# EAGLE design ntpi_adapter_v1_led (EAGLE 6.4)
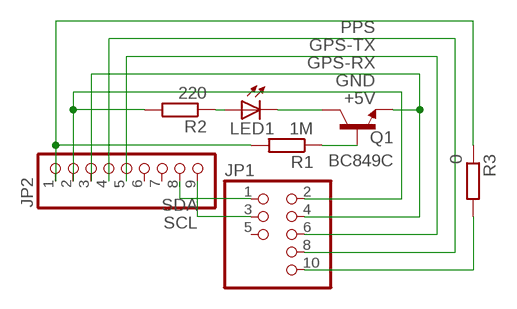
[diagram p0: schematic, sheet 1]

## Parts
JP1  PINHEAD-NTPI  [PINHEAD-NTPI]
JP2  PINHD-1X9  [1X09]
LED1  LEDCHIPLED_0805  [CHIPLED_0805]
Q1  BC849C  BC848ASMD  [SOT23]
R1  1M  R-EU_R0805W  [R0805W]
R2  220  R-EU_R0805W  [R0805W]
R3  0  R-EU_R0805W  [R0805W]

## Nets
+5V: JP1.2 JP2.2 R2.2
GND: JP1.4 JP2.3 Q1.2(E)
GPS-RX: JP1.6 JP2.5
GPS-TX: JP1.8 JP2.4
N$1: JP1.10 R3.2
N$2: LED1.A R2.1
N$3: LED1.C Q1.3(C)
N$4: Q1.1(B) R1.1
PPS: JP2.1 R1.2 R3.1
SCL: JP1.3 JP2.9
SDA: JP1.1 JP2.8
Unconnected: JP1.5 JP2.6 JP2.7

## Library data of the parts
JP1 = frell2:PINHEAD-NTPI
JP2 = pinhead:PINHD-1X9: PIN HEADER
LED1 = led:LED: LED OSRAM: - CHIPLED LG R971, LG N971, LY N971, LG Q971, LY Q971, LO R971, LY R971 LH N974, LH R974 LS Q976, LO Q976, LY Q976 LO Q996 - Hyper CHIPLED LW Q18S LB Q993, LB Q99A, LB R99A - SideLED LS A670, LO A670, LY A670, LG A670, LP A670 LB A673, LV A673, LT A673, LW A673 LH A674 LY A675 LS A676, LA A676, LO A676, LY A676, LW A676 LS A679, LY A679, LG A679 - Hyper Micro SIDELED® LS Y876, LA Y876, LO Y876, LY Y876 LT Y87S - SmartLED LW L88C, LW L88S LB L89C, LB L89S, LG L890 LS L89K, LO L89K, LY L89K LS L896, LA L896, LO L896, LY L896 - TOPLED LS T670, LO T670, LY T670, LG T670, LP T670 LSG T670, LSP T670, LSY T670, LOP T670, LYG T670 LG T671, LOG T671, LSG T671 LB T673, LV T673, LT T673, LW T673 LH T674 LS T676, LA T676, LO T676, LY T676, LB T676, LH T676, LSB T676, LW T676 LB T67C, LV T67C, LT T67C, LS T67K, LO T67K, LY T67K, LW E67C LS E67B, LA E67B, LO E67B, LY E67B, LB E67C, LV E67C, LT E67C LW T67C LS T679, LY T679, LG T679 LS T770, LO T770, LY T770, LG T770, LP T770 LB T773, LV T773, LT T773, LW T773 LH T774 LS E675, LA E675, LY E675, LS T675 LS T776, LA T776, LO T776, LY T776, LB T776 LHGB T686 LT T68C, LB T68C - Hyper Mini TOPLED® LB M676 - Mini TOPLED Santana® LG M470 LS M47K, LO M47K, LY M47K Source: http://www.osram.convergy.de LUXEON: - LUMILED® LXK2-PW12-R00, LXK2-PW12-S00, LXK2-PW14-U00, LXK2-PW14-V00 LXK2-PM12-R00, LXK2-PM12-S00, LXK2-PM14-U00 LXK2-PE12-Q00, LXK2-PE12-R00, LXK2-PE12-S00, LXK2-PE14-T00, LXK2-PE14-U00 LXK2-PB12-K00, LXK2-PB12-L00, LXK2-PB12-M00, LXK2-PB14-N00, LXK2-PB14-P00, LXK2-PB14-Q00 LXK2-PR12-L00, LXK2-PR12-M00, LXK2-PR14-Q00, LXK2-PR14-R00 LXK2-PD12-Q00, LXK2-PD12-R00, LXK2-PD12-S00 LXK2-PH12-R00, LXK2-PH12-S00 LXK2-PL12-P00, LXK2-PL12-Q00, LXK2-PL12-R00 Source: www.luxeon.com KINGBRIGHT: KA-3528ASYC Source: www.kingbright.com
Q1 = transistor-npn:BC848*: NPN Transistor
R1-R3 = resistor:R-EU_: RESISTOR, European symbol

## Board
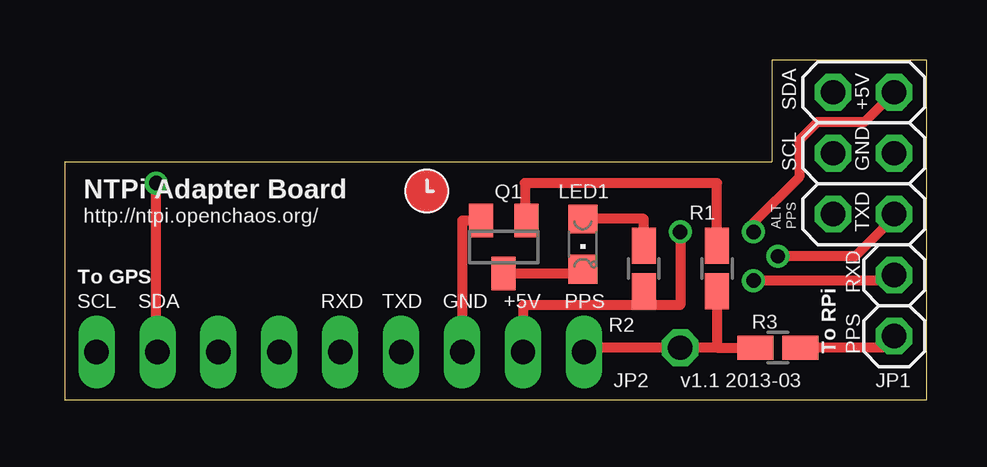
[diagram p1: board, top side]
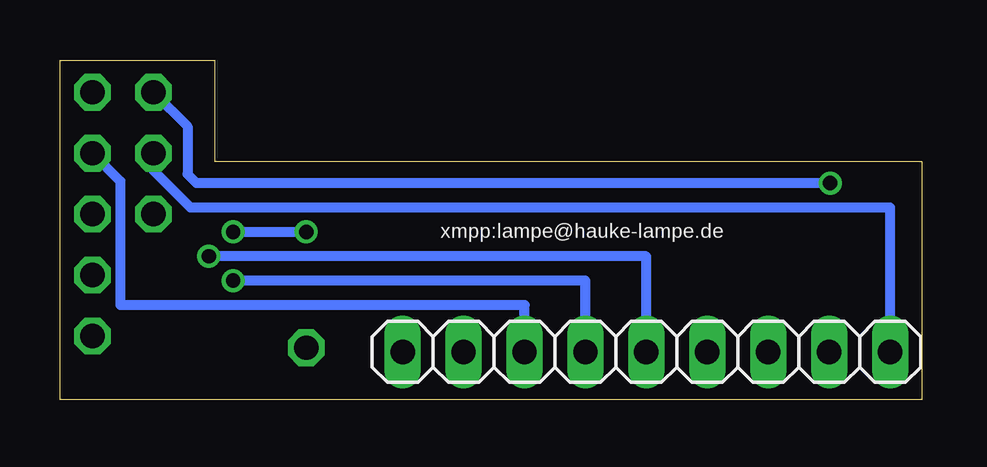
[diagram p2: board, bottom side, seen from below]

Size 35.92 x 14.15 mm. Coordinates in mm from the lower left corner, seen from the top.
Outline: 0,0 35.92,0 35.92,14.15 29.46,14.15 29.46,9.91 0,9.91 0,0
Copper layers (1*16): Top 0.0356mm / dielectric 1.5011mm / Bottom 0.0356mm
Design rules "LaenPCBOrder *": minimum track width 6mil, minimum drill 13mil, track to track 6mil, track to pad 6mil, pad to pad 6mil, via to via 6mil, smd to smd 6mil, copper to edge 15mil, drill to drill 6mil, minimum pad ring 7mil, minimum via ring 7mil, stop-mask expansion 4mil, vias tented up to drill 50mil, thermal gap 10mil

### Footprints (pad centres in the part's own frame; a part is rotated, then mirrored left to right if it is on the bottom)
PINHEAD-NTPI = drill 1.016 octagon: 1 -5.08,-1.27; 2 -5.08,1.27; 3 -2.54,-1.27; 4 -2.54,1.27; 5 0,-1.27; 6 0,1.27; 8 2.54,1.27; 10 5.08,1.27
1X09 = drill 1.016 long: 1 -10.16,0; 2 -7.62,0; 3 -5.08,0; 4 -2.54,0; 5 0,0; 6 2.54,0; 7 5.08,0; 8 7.62,0; 9 10.16,0
CHIPLED_0805 = smd 1.2 x 1.2: A 0,-1.05; C 0,1.05
SOT23 = smd 1 x 1.4: 1 -0.95,-1.1; 2 0.95,-1.1; 3 0,1.1
R0805W = smd 1.5 x 1: 1 -0.94,0; 2 0.94,0

### Placement (x,y rotation side)
JP1  33.3,7.72 270 top
JP2  11.48,1.98 0 bottom
LED1  21.59,6.48 180 top
Q1  18.29,6.36 180 top
R1  27.18,5.46 270 top
R2  24.13,5.46 270 top
R3  29.72,2.16 0 top

### Tracks (layer width: path | path; a pad name or v marks a point on that pad's centre or on a via)
+5V  (via drill 0.6)
  Top 0.406: 24.13,3.94 25.65,3.94 v25.65,6.99 | 24.13,3.94 19.1,3.94 JP2.2 | JP1.2 33.32,11.56 31.37,11.56 30.61,10.79 30.61,9.27 28.7,7.37 v28.7,6.99 | 24.13,4.7 R2.2 24.13,3.94
  Bottom 0.406: v28.7,6.99 v25.65,6.99
GND
  Top 0.406: JP2.3 16.56,7.46 Q1.2
  Bottom 0.406: JP2.3 16.56,3.94 33.4,3.94 33.4,9.1 JP1.4
GPS-RX  (via drill 0.6)
  Top 0.406: v29.72,5.97 32.94,5.97 34.57,7.6 JP1.6
  Bottom 0.406: JP2.5 11.48,5.97 v29.72,5.97
GPS-TX  (via drill 0.6)
  Top 0.406: JP1.8 34.57,4.95 v28.7,4.95
  Bottom 0.406: JP2.4 14.02,4.95 v28.7,4.95
N$1
  Top 0.406: JP1.10 34.08,2.16 R3.2
N$2
  Top 0.406: R2.1 24.13,7.53 LED1.A
N$3
  Top 0.406: Q1.3 21.59,5.25 LED1.C
N$4
  Top 0.406: R1.1 27.18,9.02 19.18,9.02 19.18,7.46 Q1.1
PPS  (via drill 1.02)
  Top 0.406: 27.18,2.16 v25.65,2.16 21.81,2.16 JP2.1 | 27.18,2.16 R3.1 | R1.2 27.18,2.16
SCL
  Bottom 0.406: JP2.9 1.32,8 30.48,8 32.03,9.55 JP1.3
SDA  (via drill 0.6)
  Top 0.406: JP2.8 3.81,2.03 v3.81,9.02
  Bottom 0.406: v3.81,9.02 30.23,9.02 30.61,9.4 30.61,11.38 JP1.1
(copper drawn outside any net)
  shapes: Top circle x1

### Text on the board
tNames: SDA | +5V | SCL | GND | NTPi Adapter Board | http://ntpi.openchaos.org/ | ALT | PPS | TXD | To GPS | SCL | SDA | RXD | TXD | GND | +5V | PPS | RXD | To RPi | PPS | v1.1 2013-03
bNames: xmpp:lampe@hauke-lampe.de